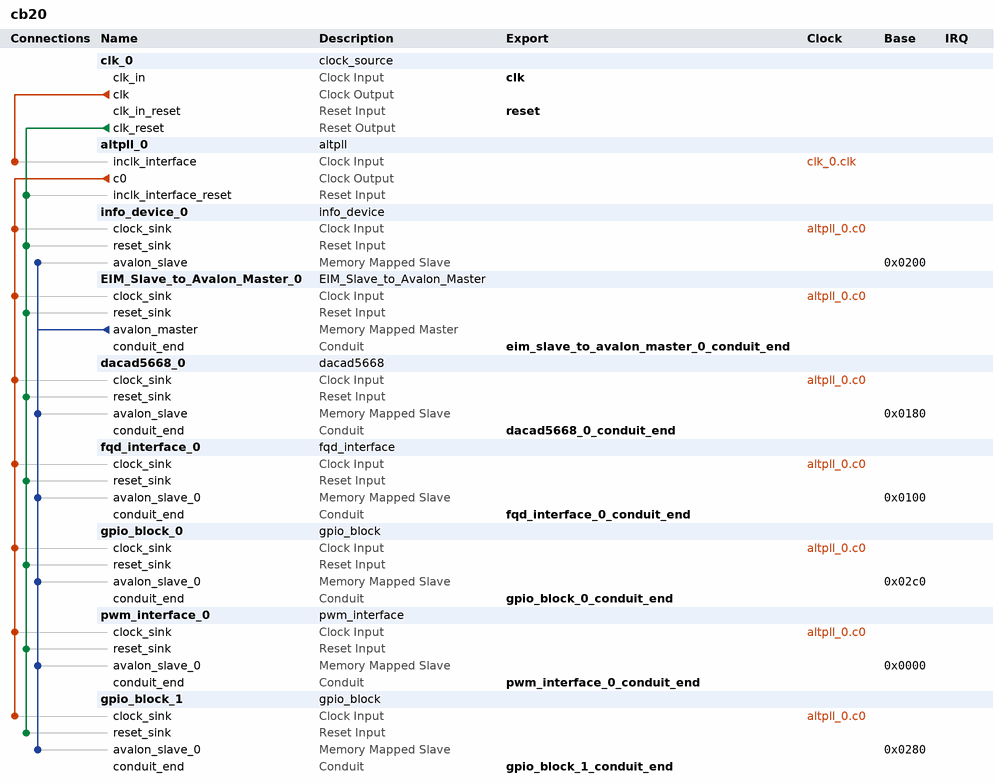
[diagram p0: system contents]
# Platform Designer (Qsys) system cb20, Cyclone IV E EP4CE22F17C8
# Parameters at their usual value, and those the tool derives, are not listed.
package require -exact qsys 13.0
create_system cb20
set_project_property DEVICE_FAMILY {Cyclone IV E}
set_project_property DEVICE EP4CE22F17C8

add_instance clk_0 clock_source 13.0
set_instance_parameter_value clk_0 clockFrequency 50000000

add_instance altpll_0 altpll 13.0
set_instance_parameter_value altpll_0 INCLK0_INPUT_FREQUENCY 20000
set_instance_parameter_value altpll_0 CLK0_MULTIPLY_BY 4
set_instance_parameter_value altpll_0 CLK0_DIVIDE_BY 1
set_instance_parameter_value altpll_0 PORT_clk1 PORT_UNUSED
set_instance_parameter_value altpll_0 PORT_clk2 PORT_UNUSED
set_instance_parameter_value altpll_0 PORT_clk3 PORT_UNUSED
set_instance_parameter_value altpll_0 PORT_ARESET PORT_UNUSED
set_instance_parameter_value altpll_0 PORT_LOCKED PORT_UNUSED

add_instance info_device_0 info_device 0.1.0
set_instance_parameter_value info_device_0 unique_id 309329921
set_instance_parameter_value info_device_0 description 10466312385840323350972952467245656131948506362191187966800747823104
set_instance_parameter_value info_device_0 dev_size 768

add_instance EIM_Slave_to_Avalon_Master_0 EIM_Slave_to_Avalon_Master 0.1.0
set_instance_parameter_value EIM_Slave_to_Avalon_Master_0 TRANSFER_WIDTH 16

add_instance dacad5668_0 dacad5668 0.1.0
set_instance_parameter_value dacad5668_0 BASE_CLK 33000000
set_instance_parameter_value dacad5668_0 SCLK_FREQUENCY 10000000
set_instance_parameter_value dacad5668_0 INTERNAL_REFERENCE 0
set_instance_parameter_value dacad5668_0 UNIQUE_ID 309338113

add_instance fqd_interface_0 fqd_interface 0.1.2
set_instance_parameter_value fqd_interface_0 number_of_fqds 8
set_instance_parameter_value fqd_interface_0 unique_id 309354497

add_instance gpio_block_0 gpio_block 0.1.2
set_instance_parameter_value gpio_block_0 number_of_gpios 9
set_instance_parameter_value gpio_block_0 unique_id 309350401

add_instance pwm_interface_0 pwm_interface 0.1.2
set_instance_parameter_value pwm_interface_0 number_of_pwms 8
set_instance_parameter_value pwm_interface_0 base_clk 200000000
set_instance_parameter_value pwm_interface_0 unique_id 309379073

add_instance gpio_block_1 gpio_block 0.1.2
set_instance_parameter_value gpio_block_1 number_of_gpios 8
set_instance_parameter_value gpio_block_1 unique_id 309350402

# connections
add_connection altpll_0.c0 dacad5668_0.clock_sink clock
add_connection altpll_0.c0 EIM_Slave_to_Avalon_Master_0.clock_sink clock
add_connection altpll_0.c0 fqd_interface_0.clock_sink clock
add_connection altpll_0.c0 gpio_block_0.clock_sink clock
add_connection altpll_0.c0 gpio_block_1.clock_sink clock
add_connection altpll_0.c0 info_device_0.clock_sink clock
add_connection altpll_0.c0 pwm_interface_0.clock_sink clock
add_connection clk_0.clk altpll_0.inclk_interface clock
add_connection clk_0.clk_reset altpll_0.inclk_interface_reset reset
add_connection clk_0.clk_reset dacad5668_0.reset_sink reset
add_connection clk_0.clk_reset EIM_Slave_to_Avalon_Master_0.reset_sink reset
add_connection clk_0.clk_reset fqd_interface_0.reset_sink reset
add_connection clk_0.clk_reset gpio_block_0.reset_sink reset
add_connection clk_0.clk_reset gpio_block_1.reset_sink reset
add_connection clk_0.clk_reset info_device_0.reset_sink reset
add_connection clk_0.clk_reset pwm_interface_0.reset_sink reset
add_connection EIM_Slave_to_Avalon_Master_0.avalon_master dacad5668_0.avalon_slave avalon
set_connection_parameter_value EIM_Slave_to_Avalon_Master_0.avalon_master/dacad5668_0.avalon_slave baseAddress 0x0180
add_connection EIM_Slave_to_Avalon_Master_0.avalon_master fqd_interface_0.avalon_slave_0 avalon
set_connection_parameter_value EIM_Slave_to_Avalon_Master_0.avalon_master/fqd_interface_0.avalon_slave_0 baseAddress 0x0100
add_connection EIM_Slave_to_Avalon_Master_0.avalon_master gpio_block_0.avalon_slave_0 avalon
set_connection_parameter_value EIM_Slave_to_Avalon_Master_0.avalon_master/gpio_block_0.avalon_slave_0 baseAddress 0x02c0
add_connection EIM_Slave_to_Avalon_Master_0.avalon_master gpio_block_1.avalon_slave_0 avalon
set_connection_parameter_value EIM_Slave_to_Avalon_Master_0.avalon_master/gpio_block_1.avalon_slave_0 baseAddress 0x0280
add_connection EIM_Slave_to_Avalon_Master_0.avalon_master info_device_0.avalon_slave avalon
set_connection_parameter_value EIM_Slave_to_Avalon_Master_0.avalon_master/info_device_0.avalon_slave baseAddress 0x0200
add_connection EIM_Slave_to_Avalon_Master_0.avalon_master pwm_interface_0.avalon_slave_0 avalon
set_connection_parameter_value EIM_Slave_to_Avalon_Master_0.avalon_master/pwm_interface_0.avalon_slave_0 baseAddress 0x0000

# exported interfaces
add_interface clk clock sink
set_interface_property clk EXPORT_OF clk_0.clk_in
add_interface reset reset sink
set_interface_property reset EXPORT_OF clk_0.clk_in_reset
add_interface eim_slave_to_avalon_master_0_conduit_end conduit end
set_interface_property eim_slave_to_avalon_master_0_conduit_end EXPORT_OF EIM_Slave_to_Avalon_Master_0.conduit_end
add_interface dacad5668_0_conduit_end conduit end
set_interface_property dacad5668_0_conduit_end EXPORT_OF dacad5668_0.conduit_end
add_interface fqd_interface_0_conduit_end conduit end
set_interface_property fqd_interface_0_conduit_end EXPORT_OF fqd_interface_0.conduit_end
add_interface gpio_block_0_conduit_end conduit end
set_interface_property gpio_block_0_conduit_end EXPORT_OF gpio_block_0.conduit_end
add_interface pwm_interface_0_conduit_end conduit end
set_interface_property pwm_interface_0_conduit_end EXPORT_OF pwm_interface_0.conduit_end
add_interface gpio_block_1_conduit_end conduit end
set_interface_property gpio_block_1_conduit_end EXPORT_OF gpio_block_1.conduit_end

set_interconnect_requirement {$system} qsys_mm.clockCrossingAdapter HANDSHAKE
set_interconnect_requirement {$system} qsys_mm.maxAdditionalLatency 1

save_system cb20.qsys
